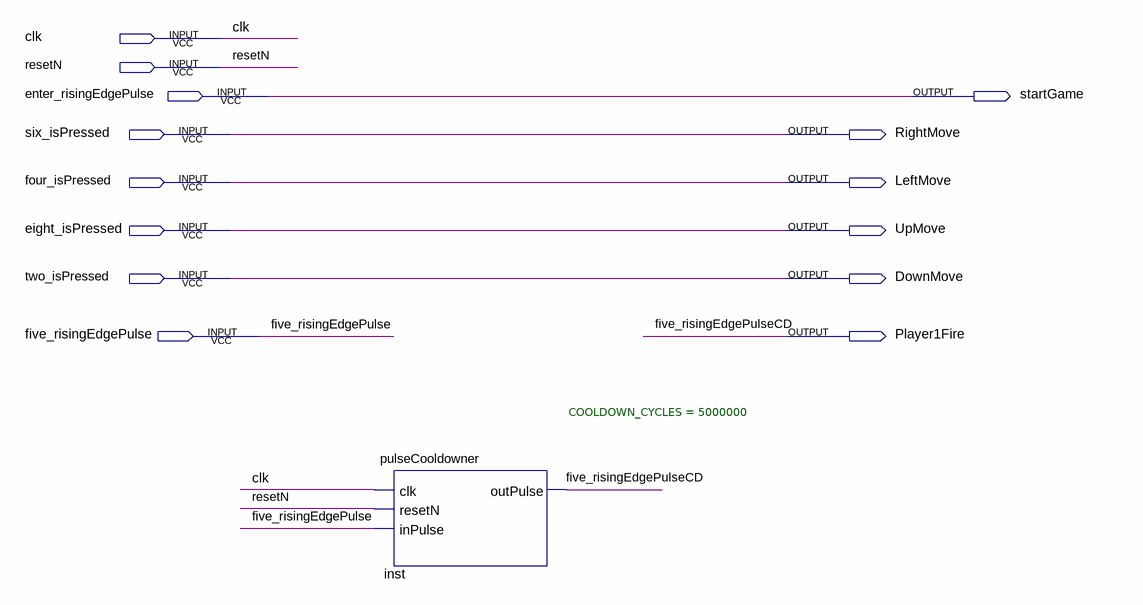
[diagram p0: schematic sheet]
// Quartus schematic game_controls.bdf as structural Verilog: 1 symbols, 14 pins
module game_controls (
  input  clk,
  input  resetN,
  input  enter_risingEdgePulse,
  input  six_isPressed,
  input  four_isPressed,
  input  eight_isPressed,
  input  two_isPressed,
  input  five_risingEdgePulse,
  output startGame,
  output RightMove,
  output LeftMove,
  output UpMove,
  output DownMove,
  output Player1Fire
);

  pulseCooldowner #(.COOLDOWN_CYCLES(5000000)) inst (
    .clk(clk), .resetN(resetN), .inPulse(five_risingEdgePulse), .outPulse(Player1Fire));

  assign DownMove = two_isPressed;
  assign LeftMove = four_isPressed;
  assign RightMove = six_isPressed;
  assign startGame = enter_risingEdgePulse;
  assign UpMove = eight_isPressed;

  // Other names for the same wires on the sheet: five_risingEdgePulseCD = Player1Fire
endmodule
